# EAGLE design PlacaLEDS (EAGLE 9.0.0)
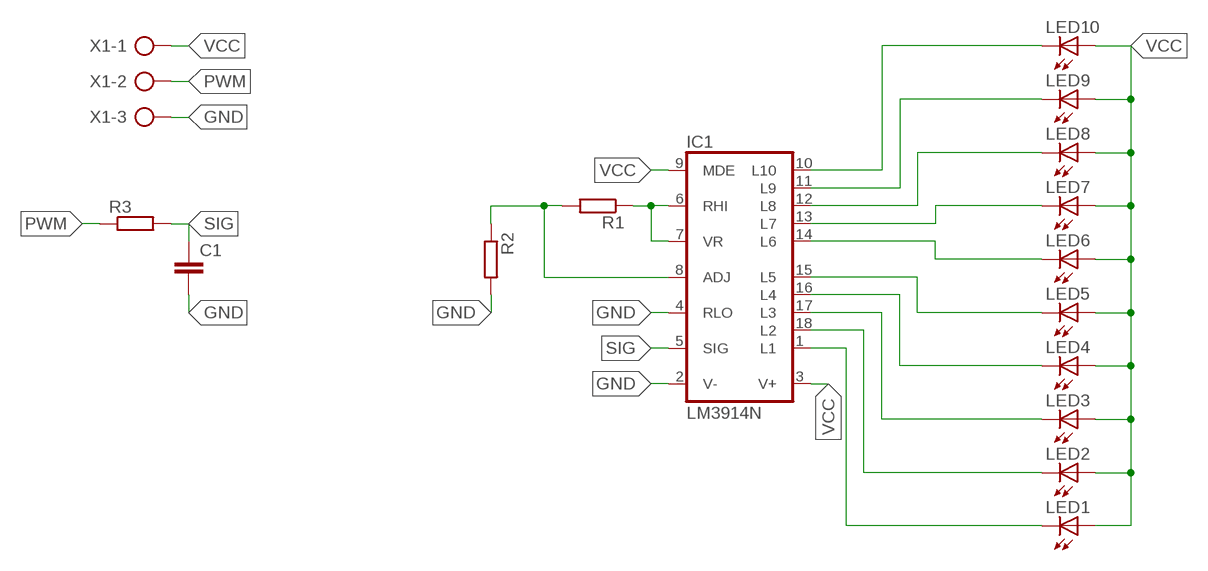
[diagram p0: schematic, sheet 1]

## Parts
C1  C-EU025-050X050  [C025-050X050]
IC1  LM3914N  [DIL18]
LED1  LED5MM  [LED5MM]
LED2  LED5MM  [LED5MM]
LED3  LED5MM  [LED5MM]
LED4  LED5MM  [LED5MM]
LED5  LED5MM  [LED5MM]
LED6  LED5MM  [LED5MM]
LED7  LED5MM  [LED5MM]
LED8  LED5MM  [LED5MM]
LED9  LED5MM  [LED5MM]
LED10  LED5MM  [LED5MM]
R1  R-EU_0204/7  [0204/7]
R2  R-EU_0204/7  [0204/7]
R3  R-EU_0204/7  [0204/7]
X1  AK500/3  [AK500/3]

## Nets
GND: C1.2 IC1.2(V-) IC1.4(RLO) R2.2 X1.3
N$1: IC1.10(L10) LED10.K(C)
N$2: IC1.11(L9) LED9.K(C)
N$3: IC1.12(L8) LED8.K(C)
N$4: IC1.13(L7) LED7.K(C)
N$5: IC1.14(L6) LED6.K(C)
N$6: IC1.15(L5) LED5.K(C)
N$7: IC1.16(L4) LED4.K(C)
N$8: IC1.17(L3) LED3.K(C)
N$9: IC1.18(L2) LED2.K(C)
N$10: IC1.1(L1) LED1.K(C)
N$12: IC1.6(RHI) IC1.7(VR) R1.1
N$14: IC1.8(ADJ) R1.2 R2.1
PWM: R3.1 X1.2
SIG: C1.1 IC1.5(SIG) R3.2
VCC: IC1.3(V+) IC1.9(MDE) LED1.A LED2.A LED3.A LED4.A LED5.A LED6.A LED7.A LED8.A LED9.A LED10.A X1.1

## Library data of the parts
C1 = rcl:C-EU: CAPACITOR, European symbol; SPICEPREFIX: C
IC1 = linear:LM3914N: LED DRIVER senses analog voltage levels and drives 10 LEDs
LED1-LED10 = led:LED: LED OSRAM: - CHIPLED LG R971, LG N971, LY N971, LG Q971, LY Q971, LO R971, LY R971 LH N974, LH R974 LS Q976, LO Q976, LY Q976 LO Q996 - Hyper CHIPLED LW Q18S LB Q993, LB Q99A, LB R99A - SideLED LS A670, LO A670, LY A670, LG A670, LP A670 LB A673, LV A673, LT A673, LW A673 LH A674 LY A675 LS A676, LA A676, LO A676, LY A676, LW A676 LS A679, LY A679, LG A679 - Hyper Micro SIDELED® LS Y876, LA Y876, LO Y876, LY Y876 LT Y87S - SmartLED LW L88C, LW L88S LB L89C, LB L89S, LG L890 LS L89K, LO L89K, LY L89K LS L896, LA L896, LO L896, LY L896 - TOPLED LS T670, LO T670, LY T670, LG T670, LP T670 LSG T670, LSP T670, LSY T670, LOP T670, LYG T670 LG T671, LOG T671, LSG T671 LB T673, LV T673, LT T673, LW T673 LH T674 LS T676, LA T676, LO T676, LY T676, LB T676, LH T676, LSB T676, LW T676 LB T67C, LV T67C, LT T67C, LS T67K, LO T67K, LY T67K, LW E67C LS E67B, LA E67B, LO E67B, LY E67B, LB E67C, LV E67C, LT E67C LW T67C LS T679, LY T679, LG T679 LS T770, LO T770, LY T770, LG T770, LP T770 LB T773, LV T773, LT T773, LW T773 LH T774 LS E675, LA E675, LY E675, LS T675 LS T776, LA T776, LO T776, LY T776, LB T776 LHGB T686 LT T68C, LB T68C - Hyper Mini TOPLED® LB M676 - Mini TOPLED Santana® LG M470 LS M47K, LO M47K, LY M47K Source: http://www.osram.convergy.de LUXEON: - LUMILED® LXK2-PW12-R00, LXK2-PW12-S00, LXK2-PW14-U00, LXK2-PW14-V00 LXK2-PM12-R00, LXK2-PM12-S00, LXK2-PM14-U00 LXK2-PE12-Q00, LXK2-PE12-R00, LXK2-PE12-S00, LXK2-PE14-T00, LXK2-PE14-U00 LXK2-PB12-K00, LXK2-PB12-L00, LXK2-PB12-M00, LXK2-PB14-N00, LXK2-PB14-P00, LXK2-PB14-Q00 LXK2-PR12-L00, LXK2-PR12-M00, LXK2-PR14-Q00, LXK2-PR14-R00 LXK2-PD12-Q00, LXK2-PD12-R00, LXK2-PD12-S00 LXK2-PH12-R00, LXK2-PH12-S00 LXK2-PL12-P00, LXK2-PL12-Q00, LXK2-PL12-R00 Source: www.luxeon.com KINGBRIGHT: KA-3528ASYC Source: www.kingbright.com
R1-R3 = rcl:R-EU_: RESISTOR, European symbol; SPICEPREFIX: R
X1 = con-ptr500:AK500/3: CONNECTOR; OC_FARNELL: unknown; OC_NEWARK: unknown

## Board
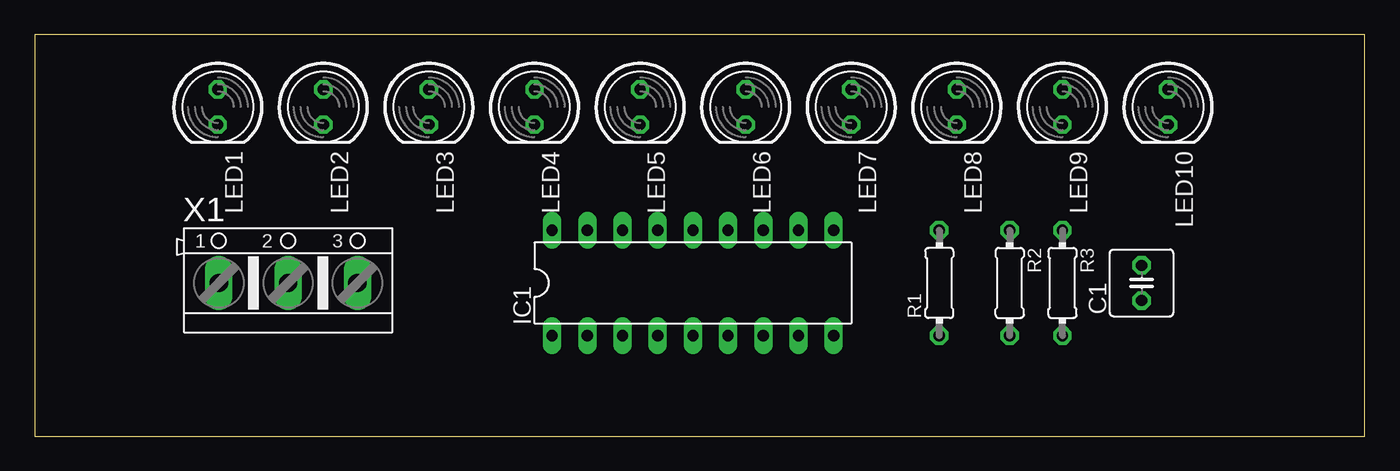
[diagram p1: board, top side]
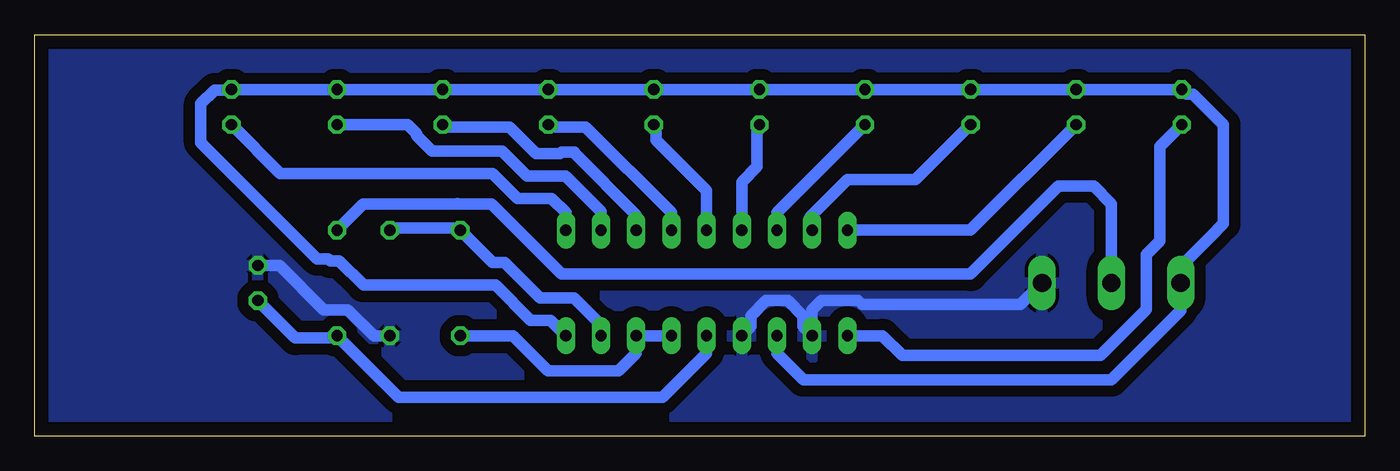
[diagram p2: board, bottom side, seen from below]

Size 96 x 29 mm. Coordinates in mm from the lower left corner, seen from the top.
Outline: 0,0 96,0 96,29 0,29 0,0
Copper layers (1*16): Top 0.035mm / dielectric 1.5mm / Bottom 0.035mm
Design rules "default *": minimum track width 32mil, minimum drill 0.35mm, track to track 32mil, track to pad 32mil, pad to pad 32mil, via to via 32mil, smd to smd 32mil, copper to edge 40mil, drill to drill 6mil, minimum pad ring 10mil, minimum via ring 8mil, stop-mask expansion 4mil, vias tented up to drill 0mil, thermal gap 10mil

### Footprints (pad centres in the part's own frame; a part is rotated, then mirrored left to right if it is on the bottom)
C025-050X050 = drill 0.813 octagon: 1 -1.27,0; 2 1.27,0
DIL18 = drill 0.813 long: 1 -10.16,-3.81; 2 -7.62,-3.81; 3 -5.08,-3.81; 4 -2.54,-3.81; 5 0,-3.81; 6 2.54,-3.81; 7 5.08,-3.81; 8 7.62,-3.81; 9 10.16,-3.81; 10 10.16,3.81; 11 7.62,3.81; 12 5.08,3.81; 13 2.54,3.81; 14 0,3.81; 15 -2.54,3.81; 16 -5.08,3.81; 17 -7.62,3.81; 18 -10.16,3.81
LED5MM = drill 0.813 octagon: A -1.27,0; K 1.27,0
0204/7 = drill 0.813 octagon: 1 -3.81,0; 2 3.81,0
AK500/3 = drill 1.321 long: 1 -5.004,0; 2 0,0; 3 5.004,0

### Placement (x,y rotation side)
C1  79.89,11.06 90 top
IC1  47.51,11.06 0 top
LED1  13.21,23.77 270 top
LED2  20.84,23.77 270 top
LED3  28.45,23.77 270 top
LED4  36.08,23.77 270 top
LED5  43.7,23.77 270 top
LED6  51.31,23.77 270 top
LED7  58.94,23.77 270 top
LED8  66.56,23.77 270 top
LED9  74.17,23.77 270 top
LED10  81.8,23.77 270 top
R1  65.28,11.06 90 top
R2  70.36,11.06 270 top
R3  74.17,11.06 270 top
X1  18.3,11.06 0 top

### Tracks (layer width: path | path; a pad name or v marks a point on that pad's centre or on a via)
GND
  Bottom 0.813: X1.3 24.86,9.5 36.27,9.5 36.57,9.79 39.2,9.79 39.88,9.12 IC1.2 40.55,7.92 40.55,8.69 41.65,9.79 43.2,9.79 44.3,8.69 44.3,7.92 IC1.4 | C1.2 78.33,12.34 75.14,9.13 73.4,9.13 71.52,7.25 R2.2
  pour Bottom: 0,0 0,28 95,28 95,0
N$1
  Bottom 0.813: IC1.10 57.66,16.14 58.68,17.16 61.14,17.16 62.95,18.96 78.26,18.96 LED10.K
N$2
  Bottom 0.813: LED9.K 69.09,22.5 68.44,21.84 68.44,21.72 67.31,20.59 62.27,20.59 60.47,18.79 57.68,18.79 55.12,16.23 IC1.11
N$3
  Bottom 0.813: IC1.12 52.59,15.99 57.03,20.43 57.03,20.51 57.98,20.51 58.07,20.41 59.8,20.41 61.72,22.34 66.4,22.34 LED8.K
N$4
  Bottom 0.813: IC1.13 50.05,16.14 56.24,22.34 58.78,22.34 LED7.K
N$5
  Bottom 0.813: IC1.14 47.51,17.73 51.16,21.38 51.16,22.5 LED6.K
N$6
  Bottom 0.813: IC1.15 44.97,18.37 43.85,19.48 43.85,22.5 LED5.K
N$7
  Bottom 0.813: IC1.16 42.42,16.14 LED4.K
N$8
  Bottom 0.813: LED3.K 32.42,18.53 37.34,18.53 40.04,15.83 40.04,14.88 IC1.17
N$9
  Bottom 0.813: LED2.K 28.45,14.88 IC1.18
N$10
  Bottom 0.813: LED1.K 14.8,20.91 14.8,14.08 15.76,13.13 15.76,9.16 19.09,5.83 33.38,5.83 34.8,7.25 IC1.1
N$12
  Bottom 0.813: IC1.6 IC1.7 52.59,5.99 53.85,4.71 58.94,4.71 61.48,7.25 R1.1
N$14
  Bottom 0.813: R2.1 70.21,15.03 65.6,15.03 R1.2 62.94,12.53 62.07,12.53 59.53,9.99 57.08,9.99 55.12,8.03 IC1.8
PWM
  Bottom 0.813: X1.2 18.3,16.78 19.57,18.05 22.11,18.05 28.45,11.7 57.98,11.7 63.04,16.75 65.41,16.75 65.48,16.79 65.58,16.75 72.3,16.75 R3.1
SIG
  Bottom 0.813: R3.2 74.02,7.25 | C1.1 77.19,7.1 74.49,7.1 R3.2 | IC1.5 47.51,5.99 50.68,2.81 69.73,2.81 R3.2
VCC
  Bottom 0.813: IC1.9 58.78,8.37 60.2,8.37 62.74,10.91 72.27,10.91 74.02,12.65 74.65,12.65 74.81,12.81 75.6,12.81 84,21.21 84,24 83,25 81.83,25 LED10.A | LED10.A 81.95,25.19 | IC1.3 42.42,5.99 40.52,4.08 18.3,4.08 13.29,9.08 X1.1 13.21,11.06 13.21,12.34 11.28,14.28 11.15,14.4 10.2,15.35 10.2,22.5 12.42,24.72 12.9,24.72 LED1.A LED2.A LED3.A LED4.A LED5.A LED6.A LED7.A LED8.A LED9.A LED10.A